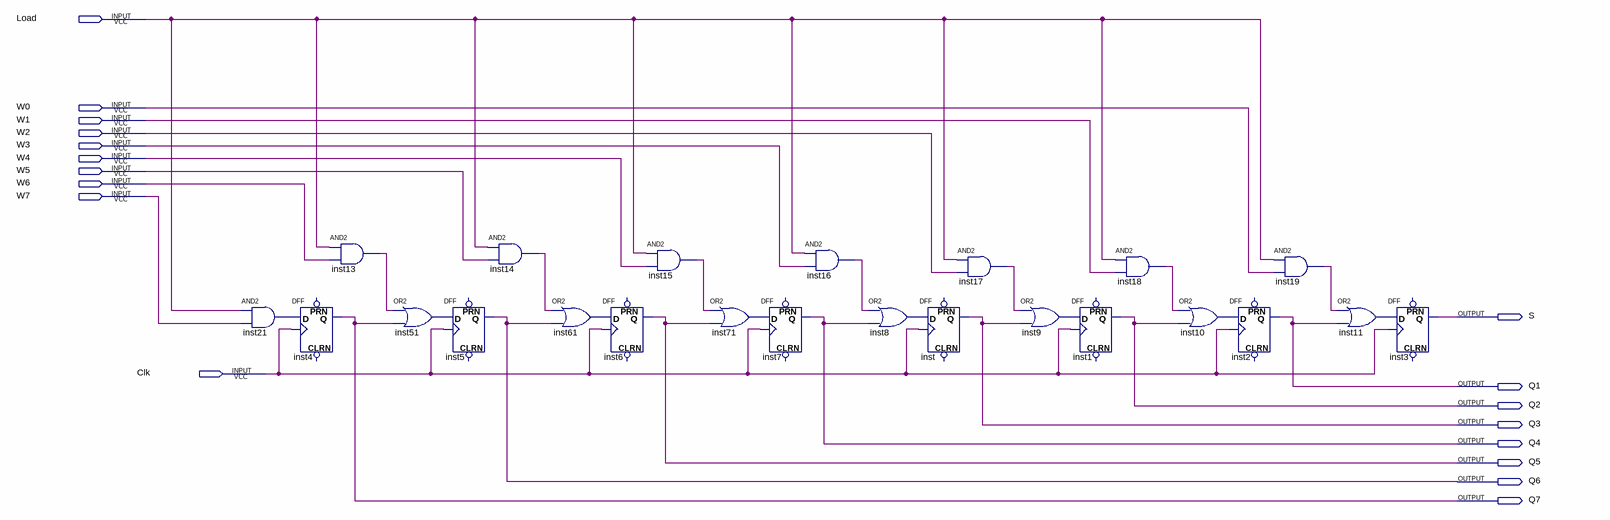
[diagram p0: schematic sheet]
// Quartus schematic 8-bit_p-in_s-out_r-s_regiser.bdf as structural Verilog: 23 symbols, 18 pins
module \8-bit_p-in_s-out_r-s_regiser  (
  input  Load,
  input  W0,
  input  W1,
  input  W2,
  input  W3,
  input  W4,
  input  W5,
  input  W6,
  input  W7,
  input  Clk,
  output S,
  output Q1,
  output Q2,
  output Q3,
  output Q4,
  output Q5,
  output Q6,
  output Q7
);

  wire inst8_out, inst9_out, inst10_out, inst11_out, inst13_out, inst14_out, inst15_out, inst16_out,
       inst17_out, inst18_out, inst19_out, inst21_out, inst51_out, inst61_out, inst71_out;

  and inst21 (inst21_out, Load, W7);
  DFF inst4 (.CLK(Clk), .D(inst21_out), .Q(Q7));  // open: CLRN, PRN
  and inst13 (inst13_out, Load, W6);
  or inst51 (inst51_out, inst13_out, Q7);
  DFF inst5 (.CLK(Clk), .D(inst51_out), .Q(Q6));  // open: CLRN, PRN
  and inst14 (inst14_out, Load, W5);
  or inst61 (inst61_out, inst14_out, Q6);
  and inst15 (inst15_out, Load, W4);
  DFF inst6 (.CLK(Clk), .D(inst61_out), .Q(Q5));  // open: CLRN, PRN
  or inst71 (inst71_out, inst15_out, Q5);
  DFF inst7 (.CLK(Clk), .D(inst71_out), .Q(Q4));  // open: CLRN, PRN
  and inst16 (inst16_out, Load, W3);
  or inst8 (inst8_out, inst16_out, Q4);
  DFF inst (.CLK(Clk), .D(inst8_out), .Q(Q3));  // open: CLRN, PRN
  and inst17 (inst17_out, Load, W2);
  or inst9 (inst9_out, inst17_out, Q3);
  DFF inst1 (.CLK(Clk), .D(inst9_out), .Q(Q2));  // open: CLRN, PRN
  and inst18 (inst18_out, Load, W1);
  or inst10 (inst10_out, inst18_out, Q2);
  DFF inst2 (.CLK(Clk), .D(inst10_out), .Q(Q1));  // open: CLRN, PRN
  and inst19 (inst19_out, Load, W0);
  or inst11 (inst11_out, inst19_out, Q1);
  DFF inst3 (.CLK(Clk), .D(inst11_out), .Q(S));  // open: CLRN, PRN
endmodule
